# EAGLE design newKalathi (EAGLE 8.2.0)
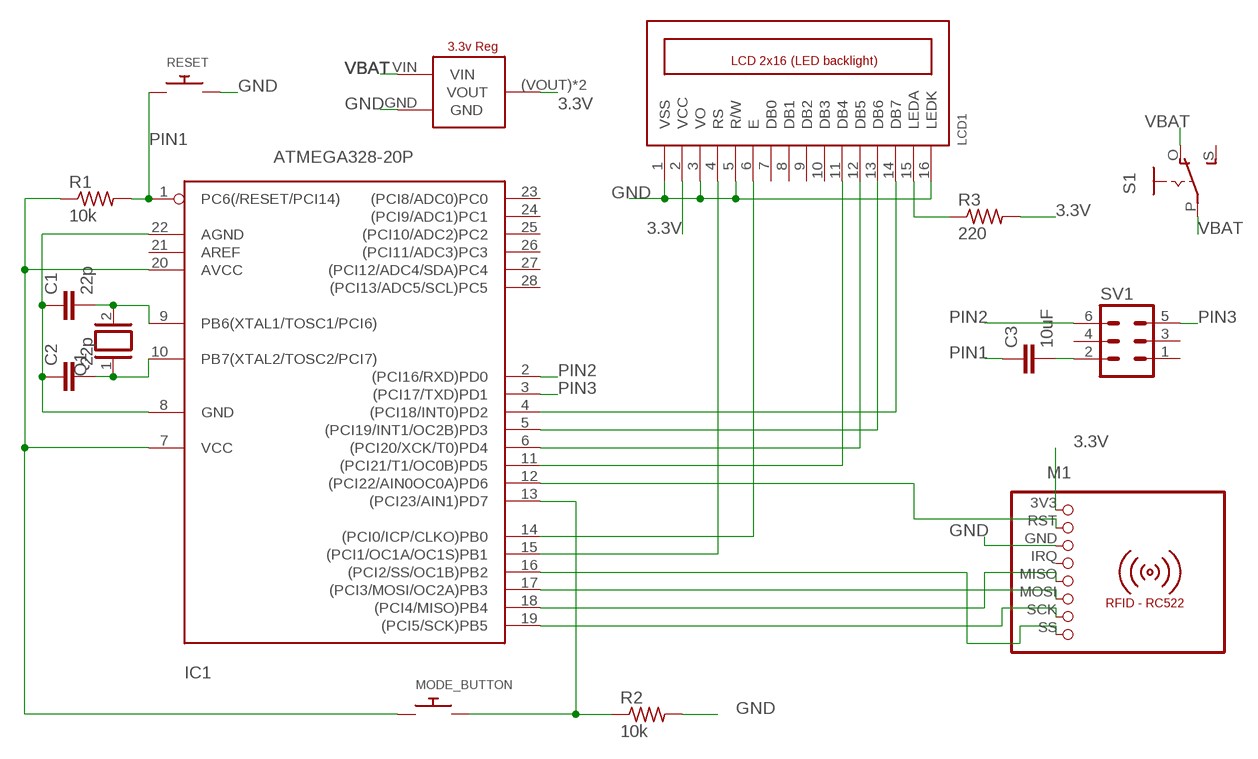
[diagram p0: schematic, sheet 1]

## Parts
C1  22p  C2,5-3  [C2.5-3]
C2  22p  C2,5-3  [C2.5-3]
C3  10uF  C5/3  [C5B3]
IC1  ATMEGA328-20P  [DIL28-3]
LCD1  LCD_2X16_SIL  [HY-1602F]
M1  RFID-RC522  [RFID-RC522]
MODE_BUTTON  SWITCH_PUSHBUTTONEVQ-PE  [TACT_PANA-EVQ]
Q1  XTAL  [Q]
R1  10k  R-US_0204/7  [0204/7]
R2  10k  R-US_0204/7  [0204/7]
R3  220  R-US_0204/7  [0204/7]
RESET  SWITCH_PUSHBUTTONEVQ-PE  [TACT_PANA-EVQ]
S1  EG1218S  [EG1218]
SV1  MA03-2  [MA03-2]
U$1  LD1117  [LD1117SOT-223]

## Nets
3.3V: IC1.7(VCC) IC1.20(AVCC) LCD1.2(VCC) M1.3V3 MODE_BUTTON.P$1 R1.1 R3.2 U$1.(VOUT)(VOUT) U$1.VOUT
GND: C1.1 C2.1 IC1.8(GND) IC1.22(AGND) LCD1.1(VSS) LCD1.3(VO) LCD1.5(R/W) LCD1.16(LEDK) M1.GND R2.2 RESET.P$2 U$1.GND
N$1: IC1.17((PCI3/MOSI/OC2A)PB3) M1.MOSI
N$2: IC1.18((PCI4/MISO)PB4) M1.MISO
N$3: IC1.19((PCI5/SCK)PB5) M1.SCK
N$4: IC1.11((PCI21/T1/OC0B)PD5) LCD1.11(DB4)
N$5: IC1.13((PCI23/AIN1)PD7) MODE_BUTTON.P$2 R2.1
N$6: IC1.16((PCI2/SS/OC1B)PB2) M1.SS
N$7: IC1.12((PCI22/AIN0OC0A)PD6) M1.RST
N$8: IC1.4((PCI18/INT0)PD2) LCD1.14(DB7)
N$9: IC1.5((PCI19/INT1/OC2B)PD3) LCD1.13(DB6)
N$10: IC1.6((PCI20/XCK/T0)PD4) LCD1.12(DB5)
N$12: IC1.14((PCI0/ICP/CLKO)PB0) LCD1.6(E)
N$13: IC1.15((PCI1/OC1A/OC1S)PB1) LCD1.4(RS)
N$14: LCD1.15(LEDA) R3.1
N$16: C1.2 IC1.9(PB6(XTAL1/TOSC1/PCI6)) Q1.2
N$17: C2.2 IC1.10(PB7(XTAL2/TOSC2/PCI7)) Q1.1
N$19: C3.2 SV1.2
PIN1: C3.1 IC1.1(PC6(/RESET/PCI14)) R1.2 RESET.P$1
PIN2: IC1.2((PCI16/RXD)PD0) SV1.6
PIN3: IC1.3((PCI17/TXD)PD1) SV1.5
VBAT: S1.O S1.P U$1.VIN
Unconnected: IC1.21(AREF) IC1.23((PCI8/ADC0)PC0) IC1.24((PCI9/ADC1)PC1) IC1.25((PCI10/ADC2)PC2) IC1.26((PCI11/ADC3)PC3) IC1.27((PCI12/ADC4/SDA)PC4) IC1.28((PCI13/ADC5/SCL)PC5) LCD1.7(DB0) LCD1.8(DB1) LCD1.9(DB2) LCD1.10(DB3) M1.IRQ S1.S SV1.1 SV1.3 SV1.4

## Library data of the parts
C1-C3 = capacitor-wima:C: CAPACITOR naming: grid - package width
IC1 = atmega328:ATMEGA328*P: MICROCONTROLLER 32 kBytes FLASH 2 kBytes SRAM 1 kBytes EEPROM USART 8-channel 10 bit ADC
LCD1 = LCD_2x16_LED_backlight:LCD_2X16_SIL
M1 = mfrc522-module:RFID-RC522: RFID-RC522 MFRC-522 based breakout board
MODE_BUTTON RESET = adafruit:SWITCH_PUSHBUTTON: Buttons SOFTTOUCHSMD_SJ - Soft touch temporary push button (Super Junk Akihabara) Compatible with SKPMANE010 [Mouser: 688-SKPMAN] C&K_KSS = Digikey: KSS221GLFS
Q1 = special:XTAL: CRYSTAL
R1-R3 = adafruit:R-US_: RESISTOR, American symbol
S1 = adafruit:EG1218: SLIDING SWITCH 0.1" spacing through hole, vertical SPDT slide switch http://www.ladyada.net/library/pcb/eaglelibrary.html
SV1 = con-lstb:MA03-2: PIN HEADER; OC_FARNELL: unknown; OC_NEWARK: unknown
U$1 = LD1117:LD1117

## Board
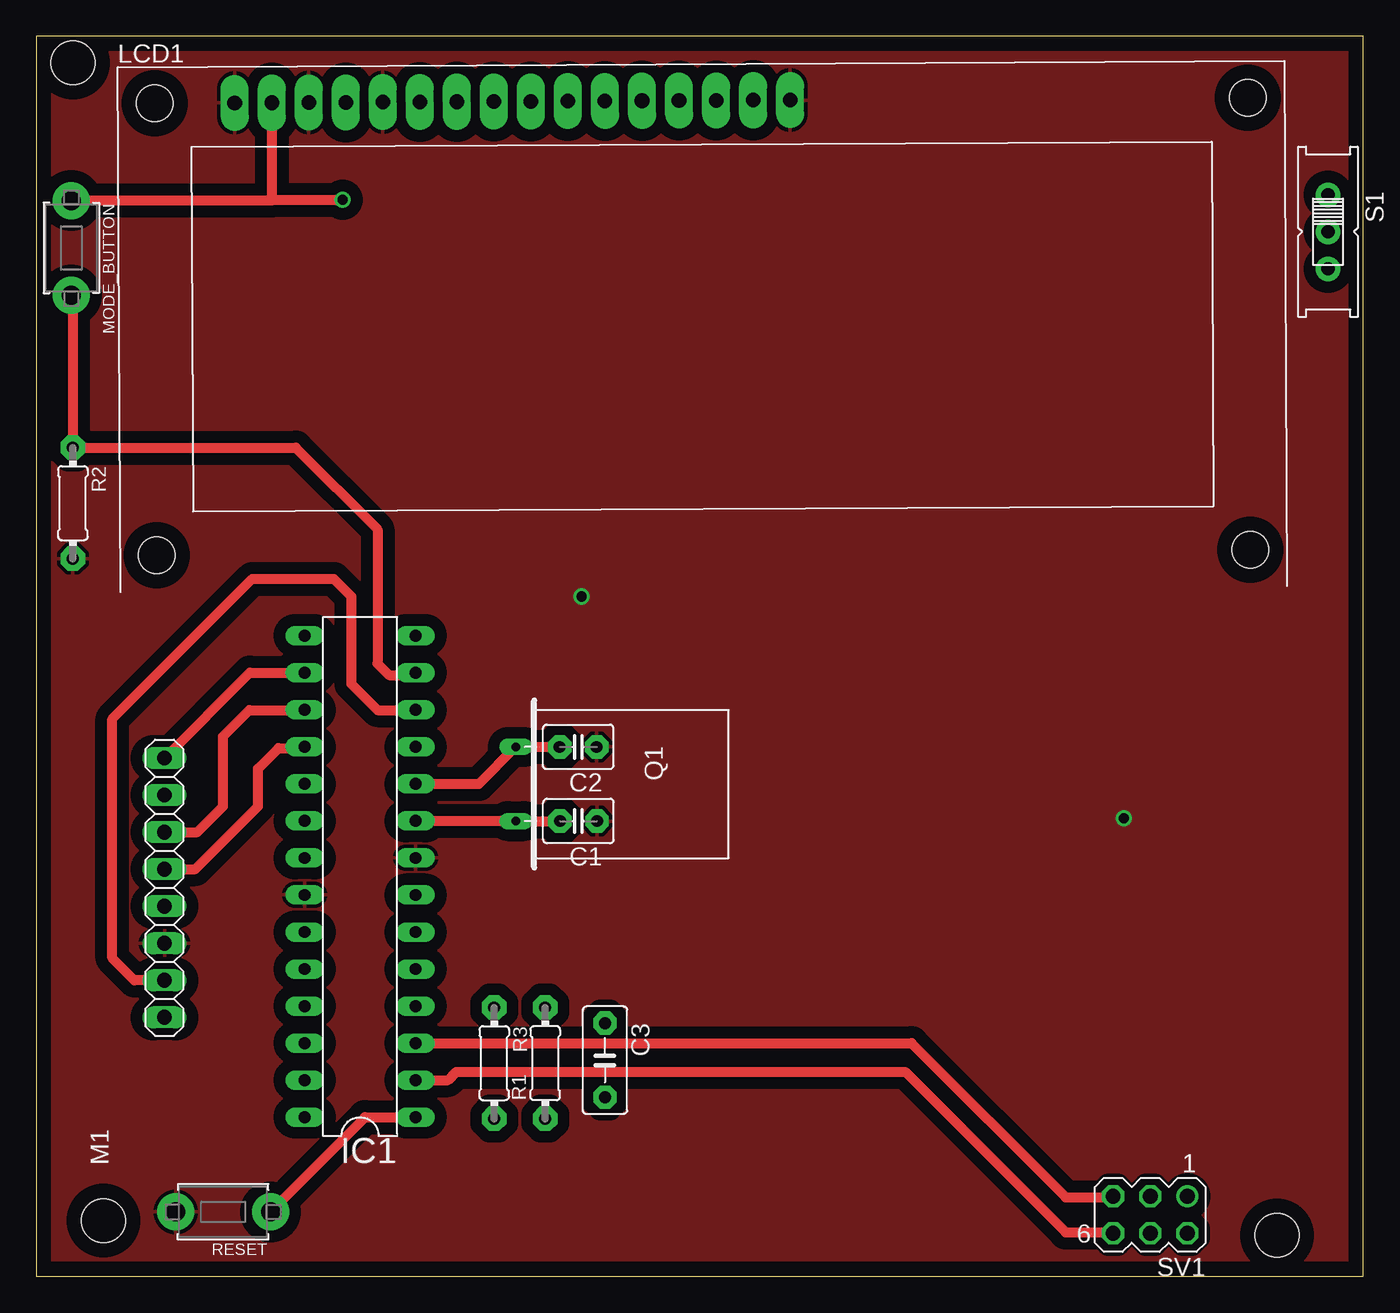
[diagram p1: board, top side]
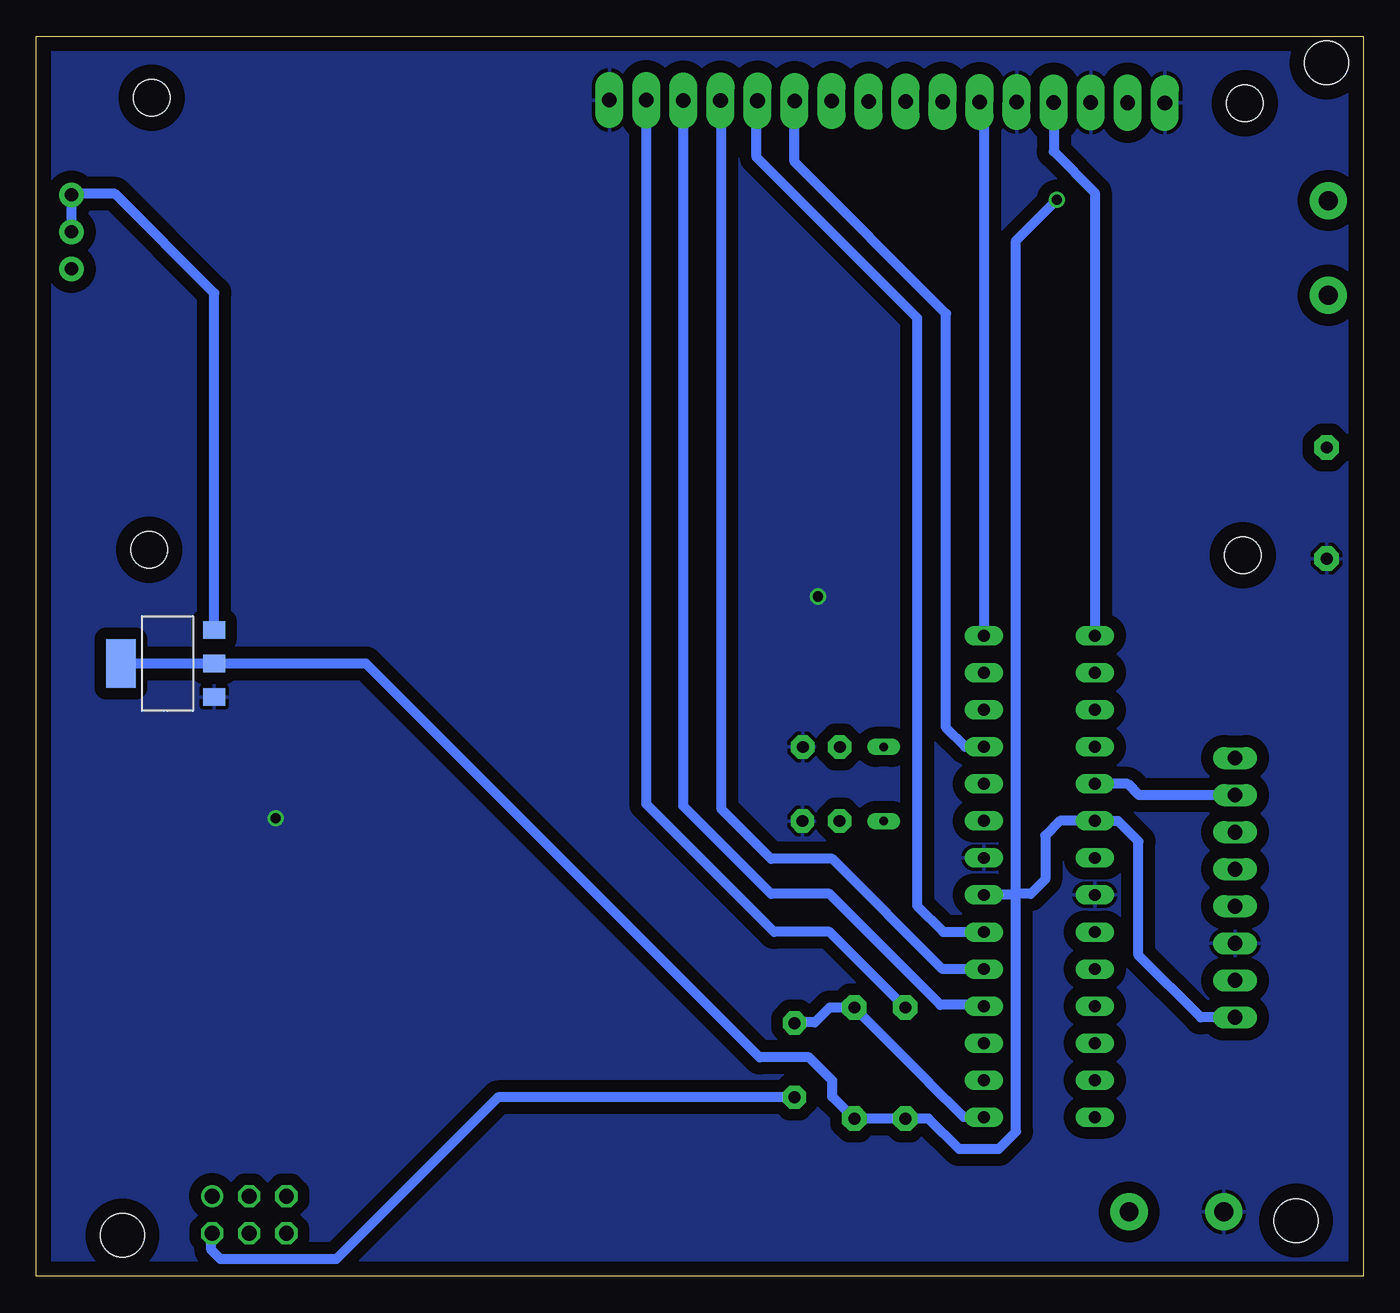
[diagram p2: board, bottom side, seen from below]

Size 91 x 85 mm. Coordinates in mm from the lower left corner, seen from the top.
Outline: 0,0 91,0 91,85 0,85 0,0
Copper layers (1*16): Top 0.035mm / dielectric 1.5mm / Bottom 0.035mm
Design rules "default *": minimum track width 6mil, minimum drill 0.35mm, track to track 6mil, track to pad 6mil, pad to pad 6mil, via to via 6mil, smd to smd 6mil, copper to edge 40mil, drill to drill 6mil, minimum pad ring 10mil, minimum via ring 8mil, stop-mask expansion 4mil, vias tented up to drill 0mil, thermal gap 10mil
Holes 3 mm at 2.5,83.2 85.1,2.8 4.6,3.8

### Footprints (pad centres in the part's own frame; a part is rotated, then mirrored left to right if it is on the bottom)
C2.5-3 = drill 0.813 pad 1.6 octagon: 1 -1.27,0; 2 1.27,0
C5B3 = drill 0.813 pad 1.6 octagon: 1 -2.54,0; 2 2.54,0
DIL28-3 = drill 0.813 long: 1 -16.51,-3.81; 2 -13.97,-3.81; 3 -11.43,-3.81; 4 -8.89,-3.81; 5 -6.35,-3.81; 6 -3.81,-3.81; 7 -1.27,-3.81; 8 1.27,-3.81; 9 3.81,-3.81; 10 6.35,-3.81; 11 8.89,-3.81; 12 11.43,-3.81; 13 13.97,-3.81; 14 16.51,-3.81; 15 16.51,3.81; 16 13.97,3.81; 17 11.43,3.81; 18 8.89,3.81; 19 6.35,3.81; 20 3.81,3.81; 21 1.27,3.81; 22 -1.27,3.81; 23 -3.81,3.81; 24 -6.35,3.81; 25 -8.89,3.81; 26 -11.43,3.81; 27 -13.97,3.81; 28 -16.51,3.81
HY-1602F = drill 1 pad 1.93 long: 1 2.54,0; 2 5.08,0; 3 7.62,0; 4 10.16,0; 5 12.7,0; 6 15.24,0; 7 17.78,0; 8 20.32,0; 9 22.86,0; 10 25.4,0; 11 27.94,0; 12 30.48,0; 13 33.02,0; 14 35.56,0; 15 38.1,0; 16 40.64,0 | hole 2.5: -2.96,0; 72.04,0; -2.96,-31; 72.04,-31
RFID-RC522 = drill 1.016 long: 3V3 -8.89,0; GND -3.81,0; IRQ -1.27,0; MISO 1.27,0; MOSI 3.81,0; RST -6.35,0; SCK 6.35,0; SS 8.89,0
TACT_PANA-EVQ = drill 1.3 pad 2.54: P$1 -3.25,0; P$2 3.25,0
Q = drill 0.61 long: 1 -2.54,-7.62; 2 2.54,-7.62
0204/7 = drill 0.813 pad 1.676 octagon: 1 -3.81,0; 2 3.81,0
EG1218 = drill 0.9 pad 1.676: O -2.54,0; P 0,0; S 2.54,0
MA03-2 = drill 1.016: 1 -2.54,-1.27 | drill 1.016 octagon: 2 -2.54,1.27; 3 0,-1.27; 4 0,1.27; 5 2.54,-1.27; 6 2.54,1.27
LD1117SOT-223 = smd 3.3 x 2: (VOUT) 0,3.2 | smd 1.2 x 1.5: GND -2.3,-3.2; VIN 2.3,-3.2; VOUT 0,-3.2

### Placement (x,y rotation side)
C1  37.18,31.2 180 top
C2  37.16,36.28 180 top
C3  39,14.8 270 top
IC1  22.2,27.4 90 top
LCD1  11.06,80.43 0.3 top
M1  8.78,26.63 90 top
MODE_BUTTON  2.39,70.5 270 top
Q1  40.5,33.74 270 top
R1  34.9,14.6 90 top
R2  2.5,53 270 top
R3  31.4,14.6 270 top
RESET  12.8,4.4 180 top
S1  88.6,71.6 270 top
SV1  76.4,4.2 180 top
U$1  82,42 90 bottom

### Tracks (layer width: path | path; a pad name or v marks a point on that pad's centre or on a via)
3.3V  (via drill 0.7)
  Top 0.305: 16.2,78.6 16.2,80.4 | 16.14,73.75 16.19,73.8
  Top 0.7: 16.2,80.4 LCD1.2 16.14,73.75 MODE_BUTTON.P$1 | 16.19,73.8 v21,73.8
  Bottom 0.305: 24.93,26.13 IC1.7 | IC1.20 | 23.8,26.2 23.87,26.13 | R3.2
  Bottom 0.7: 23.8,26.2 23.8,9.9 25,8.7 27.7,8.7 29.8,10.8 R3.2 | M1.3V3 11.14,17.74 15.4,22 15.4,29.8 16.8,31.2 IC1.20 | 23.87,26.13 IC1.7 | IC1.20 20.79,31.21 21.8,30.2 21.8,27.2 22.8,26.2 23.8,26.2 | R3.2 R1.1 36.4,12.29 36.4,13.4 38,15 41.4,15 68.4,42 U$1.VOUT U$1.(VOUT) | 23.8,26.2 23.8,71 v21,73.8
GND  (via drill 0.7)
  other vias: 37.4,46.6 74.6,31.4
  pour Top (isolate 0.813): -0.4,85.4 -0.4,-0.6 91.4,-0.6 91.4,85.4
  pour Bottom (isolate 0.813): -0.6,85.6 -0.6,-0.8 91.6,-0.8 91.6,85.6
N$1
  Top 0.508: 18.36,38.8 IC1.17
  Top 0.7: M1.MOSI 11.04,30.44 12.8,32.2 12.8,37 14.6,38.8 18.36,38.8
N$2
  Top 0.508: 18.3,36.2 IC1.18
  Top 0.7: M1.MISO 10.9,27.9 15.2,32.2 15.2,34.8 16.6,36.2 18.3,36.2
N$3
  Bottom 0.7: M1.SCK 15.38,32.98 16.15,33.75 IC1.19
N$4
  Bottom 0.7: IC1.11 27.29,36.29 28.6,37.6 28.6,66 39,76.4 LCD1.11 | LCD1.11
N$5
  Top 0.305: 2.5,67.14 MODE_BUTTON.P$2
  Top 0.7: 2.5,67.14 R2.1 17.79,56.81 23.4,51.2 23.4,42 24.2,41.2 25.84,41.2 IC1.13
N$6
  Top 0.7: M1.SS 14.63,41.37 IC1.16
N$7
  Top 0.7: M1.RST 6.72,20.28 5.2,21.8 5.2,38.2 14.8,47.8 20.4,47.8 21.6,46.6 21.6,40.6 23.4,38.8 25.98,38.8 IC1.12
N$8
  Bottom 0.7: IC1.4 26.1,18.6 29,18.6 36.6,26.2 40.6,26.2 46.62,32.22 LCD1.14
N$9
  Bottom 0.305: 44,80.52 LCD1.13
  Bottom 0.7: IC1.5 28.85,21.05 36.4,28.6 40.6,28.6 44,32 44,80.52
N$10
  Bottom 0.305: IC1.6
  Bottom 0.7: LCD1.12 41.6,80.53 41.6,76.7 30.6,65.7 30.6,25.4 28.8,23.6 IC1.6
N$12
  Bottom 0.7: LCD1.6 26.01,80.22 IC1.14
N$13
  Bottom 0.7: LCD1.4 21.22,77.12 18.4,74.3 IC1.15
N$14
  Bottom 0.7: R3.1 36.59,23.6 40.4,23.6 49.16,32.36 LCD1.15
N$16
  Top 0.7: IC1.9 Q1.2 C1.2
N$17
  Top 0.7: IC1.10 30.35,33.75 Q1.1 C2.2
N$19
  Bottom 0.7: C3.2 59.34,12.26 70.43,1.17 78.37,1.17 79,1.8 79,2.87 SV1.2
PIN1
  Top 0.7: RESET.P$1 22.54,10.89 IC1.1
  Bottom 0.305: 29.8,13.3 29.8,13.31
  Bottom 0.7: IC1.1 27.39,10.89 29.8,13.3 | 29.8,13.31 R1.2 36.59,18.41 37.6,17.4 38.94,17.4 C3.1
PIN2
  Top 0.508: 73.79,3 SV1.6
  Top 0.7: IC1.2 28.23,13.43 28.8,14 59.6,14 70.6,3 73.79,3
PIN3
  Top 0.508: 73.79,5.4 SV1.5
  Top 0.7: IC1.3 60.03,15.97 70.6,5.4 73.79,5.4
VBAT
  Bottom 0.305: 88.54,74.2 S1.O
  Bottom 0.7: S1.O S1.P | U$1.VIN 78.8,67.4 85.6,74.2 88.54,74.2